# EAGLE design pcb (EAGLE 9.6.2)
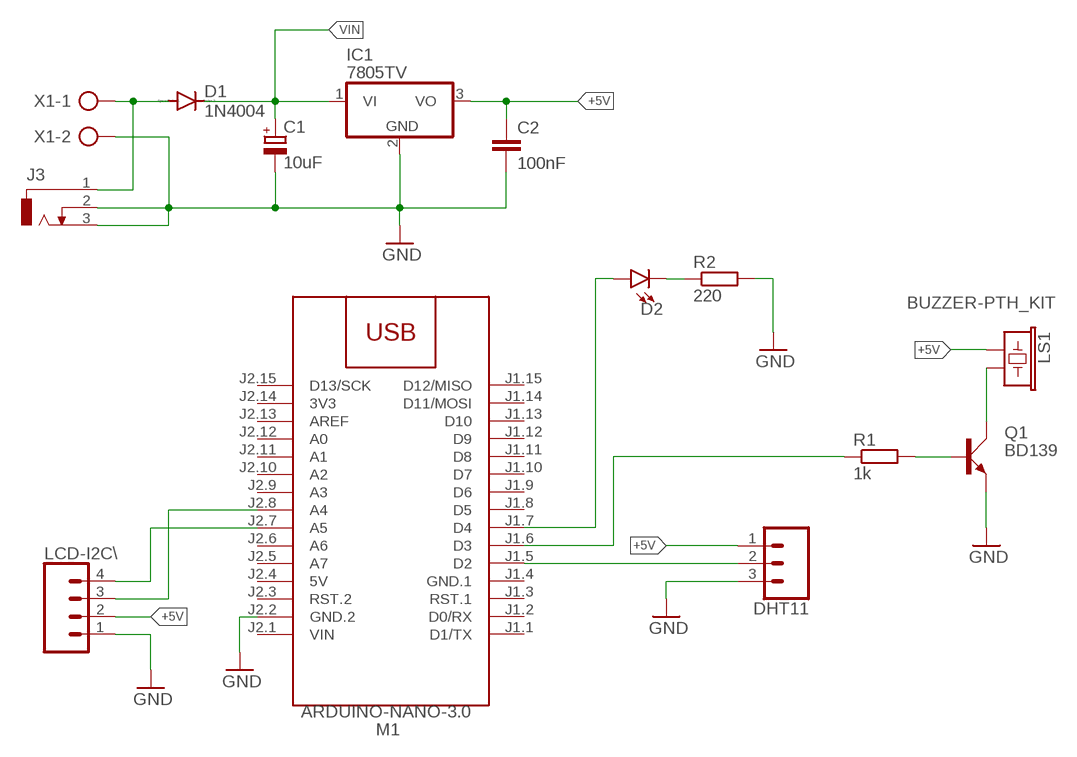
[diagram p0: schematic, sheet 1]

## Parts
C1  10uF  CPOL-EUE2.5-6  [E2,5-6]
C2  100nF  C-EU050-025X075  [C050-025X075]
D1  1N4004  [DO41-10]
D2  LED5MM  [LED_5MM]
DHT11  CONN_03LONGPADS  [1X03_LONGPADS]
IC1  7805TV  [TO220V]
J3  DCJ0303  [DCJ0303]
LCD-I2C\  CONN_04LONGPADS  [1X04_LONGPADS]
LS1  BUZZER-PTH_KIT  [BUZZER-12MM-KIT]
M1  ARDUINO-NANO-3.0  [ARDUINO-NANO-3.0]
Q1  BD139  [TO126AV]
R1  1k  R-EU_0207/10  [0207/10]
R2  220  R-EU_0207/10  [0207/10]
X1  AK300/2  [AK300/2]

## Nets
+5V: C2.1 DHT11.1 IC1.3(VO) LCD-I2C\.2 LS1.+
GND: C1.- C2.2 DHT11.3 IC1.2(GND) J3.2 J3.3 LCD-I2C\.1 M1.J2.2(GND.2) Q1.E R2.2 X1.2
N$1: M1.J1.6(D3) R1.1
N$2: DHT11.2 M1.J1.5(D2)
N$3: LCD-I2C\.4 M1.J2.7(A5)
N$4: D1.A J3.1 X1.1
N$5: LCD-I2C\.3 M1.J2.8(A4)
N$6: Q1.B R1.2
N$7: LS1.- Q1.C
N$8: D2.K(C) R2.1
N$9: D2.A M1.J1.7(D4)
VIN: C1.+ D1.C IC1.1(VI)
Unconnected: M1.J1.1(D1/TX) M1.J1.2(D0/RX) M1.J1.3(RST.1) M1.J1.8(D5) M1.J1.9(D6) M1.J1.10(D7) M1.J1.11(D8) M1.J1.12(D9) M1.J1.13(D10) M1.J1.14(D11/MOSI) M1.J1.15(D12/MISO) M1.J2.3(RST.2) M1.J2.5(A7) M1.J2.6(A6) M1.J2.9(A3) M1.J2.10(A2) M1.J2.11(A1) M1.J2.12(A0) M1.J2.13(AREF) M1.J2.15(D13/SCK)

## Power pins joined to a net without a drawn wire
3V3: M1.J2.14(3V3)
5V: M1.J2.4(5V)
GND.1: M1.J1.4(GND.1)
VIN: M1.J2.1(VIN)

## Library data of the parts
C1 = rcl:CPOL-EU: POLARIZED CAPACITOR, European symbol; SPICEPREFIX: C
C2 = rcl:C-EU: CAPACITOR, European symbol; SPICEPREFIX: C
D1 = diode:1N4004: DIODE general purpose rectifier, 1 A
D2 = SparkFun-LED:LED: LED (Generic) Standard schematic elements and footprints for 5mm, 3mm, 1206, and 0603 sized LEDs. Generic LEDs with no color specified.
DHT11 = SparkFun-Connectors:CONN_03: Multi connection point. Often used as Generic Header-pin footprint for 0.1 inch spaced/style header connections On any of the 0.1 inch spaced packages, you can populate with these: Break Away Headers - Straight <https://www.sparkfun.com/products/116> (PRT-00116) Break Away Male Headers - Right Angle <https://www.sparkfun.com/products/553> (PRT-00553) Female Headers <https://www.sparkfun.com/products/115> (PRT-00115) Break Away Headers - Machine Pin <https://www.sparkfun.com/products/117> (PRT-00117) Break Away Female Headers - Swiss Machine Pin <https://www.sparkfun.com/products/743> (PRT-00743) Stackable Header - 3 Pin (Female, 0.1") <https://www.sparkfun.com/products/13875> (PRT-13875) For SCREWTERMINALS and SPRING TERMINALS visit here: Screw Terimnals on SparkFun.com <https://www.sparkfun.com/search/results?term=Screw+Terminals> (5mm/3.5mm/2.54mm spacing) This device is also useful as a general connection point to wire up your design to another part of your project. Our various solder wires solder well into these plated through hole pads. Hook-Up Wire - Assortment (Stranded, 22 AWG) <https://www.sparkfun.com/products/11375> (PRT-11375) Hook-Up Wire - Assortment (Solid Core, 22 AWG) <https://www.sparkfun.com/products/11367> (PRT-11367) View the entire wire category on our website here <https://www.sparkfun.com/categories/141> Special notes: Molex polarized connector foot print use with SKU : PRT-08232 with associated crimp pins and housings.
IC1 = linear:78*: Positive VOLTAGE REGULATOR Source: http://cache.national.com/ds/LM/LM78L05.pdf http://www.fairchildsemi.com/ds/LM/LM7805.pdf
J3 = con-jack:DCJ0303: DC POWER JACK Source: DCJ0303.pdf; OC_FARNELL: unknown; OC_NEWARK: unknown
LCD-I2C\ = SparkFun-Connectors:CONN_04: Multi connection point. Often used as Generic Header-pin footprint for 0.1 inch spaced/style header connections On any of the 0.1 inch spaced packages, you can populate with these: Break Away Headers - Straight <https://www.sparkfun.com/products/116> (PRT-00116) Break Away Male Headers - Right Angle <https://www.sparkfun.com/products/553> (PRT-00553) Female Headers <https://www.sparkfun.com/products/115> (PRT-00115) Break Away Headers - Machine Pin <https://www.sparkfun.com/products/117> (PRT-00117) Break Away Female Headers - Swiss Machine Pin <https://www.sparkfun.com/products/743> (PRT-00743) For SCREWTERMINALS and SPRING TERMINALS visit here: Screw Terimnals on SparkFun.com <https://www.sparkfun.com/search/results?term=Screw+Terminals> (5mm/3.5mm/2.54mm spacing) This device is also useful as a general connection point to wire up your design to another part of your project. Our various solder wires solder well into these plated through hole pads. Hook-Up Wire - Assortment (Stranded, 22 AWG) <https://www.sparkfun.com/products/11375> (PRT-11375) Hook-Up Wire - Assortment (Solid Core, 22 AWG) <https://www.sparkfun.com/products/11367> (PRT-11367) View the entire wire category on our website here <https://www.sparkfun.com/categories/141> Special notes: Molex polarized connector foot print use with SKU : PRT-08231 with associated crimp pins and housings. 1MM SMD Version SKU: PRT-10208; PROD_ID: CONN-09696
LS1 = SparkFun-Electromechanical:BUZZER: Buzzer Small round buzzers that operate around the audible 2kHz range. You can use these as speakers to create simple music or user interfaces. Variant Overview: PTH - Mini Speaker - PC Mount 12mm 2.048kHz <https://www.sparkfun.com/products/7950> PTH_KIT - Mini Speaker - PC Mount 12mm 2.048kHz <https://www.sparkfun.com/products/7950> KIT simplifies soldering by adding stop mask to one side of the pads. PTH_NO_SILK - Mini Speaker - PC Mount 12mm 2.048kHz <https://www.sparkfun.com/products/7950> No silkscreen indicator of buzzer outline. PTH_KIT_NO_SILK - Mini Speaker - PC Mount 12mm 2.048kHz <https://www.sparkfun.com/products/7950> KIT package w/o silkscreen SMD - Buzzer Audio Magnetic (CCV-084B16) SMD buzzer used on, e.g. the LilyPad Buzzer <https://www.sparkfun.com/products/8463> and RFID USB Reader <https://www.sparkfun.com/products/9963>. SMD_KIT - Buzzer Audio Magnetic (CCV-084B16) SMD Buzzer with elongated pins to make soldering easier. Used on the SparkFun Simon Says - Surface Mount Soldering Kit <https://www.sparkfun.com/products/10935>.; PROD_ID: COMP-08253; SF_SKU: COM-07950
M1 = diy-modules:ARDUINO-NANO-3.0: Arduino Nano 3.0 and compatible devices More details available here: https://www.arduino.cc/en/Main/ArduinoBoardNano Click here to find device on ebay.com <http://www.ebay.com/sch/arduino+nano>
Q1 = transistor-power:BD139: NPN TRANSISTOR
R1 R2 = rcl:R-EU_: RESISTOR, European symbol; SPICEPREFIX: R
X1 = con-ptr500:AK300/2: CONNECTOR; OC_FARNELL: unknown; OC_NEWARK: unknown

## Board
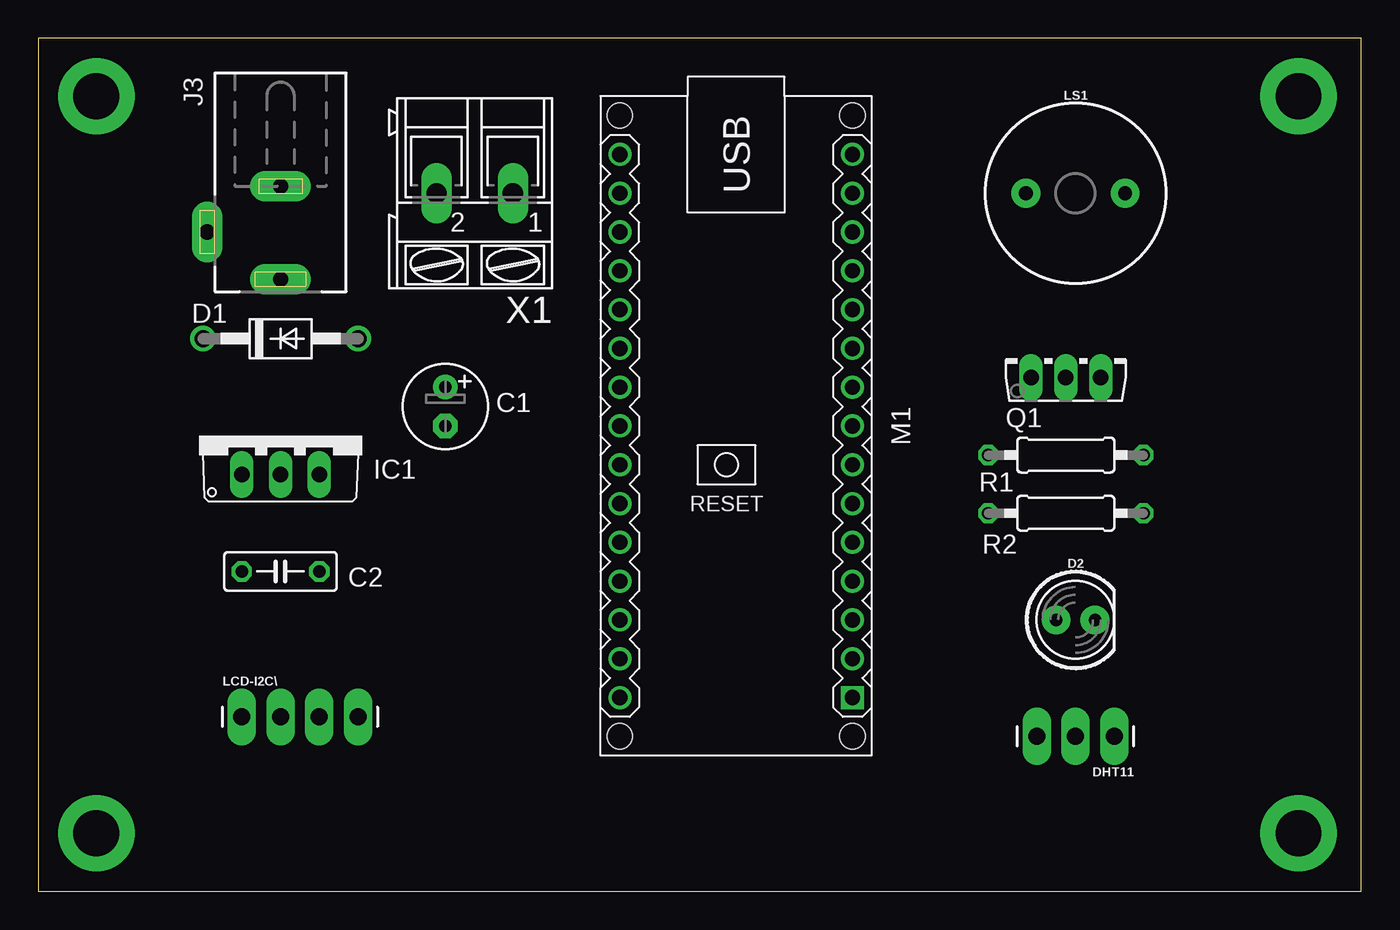
[diagram p1: board, top side]
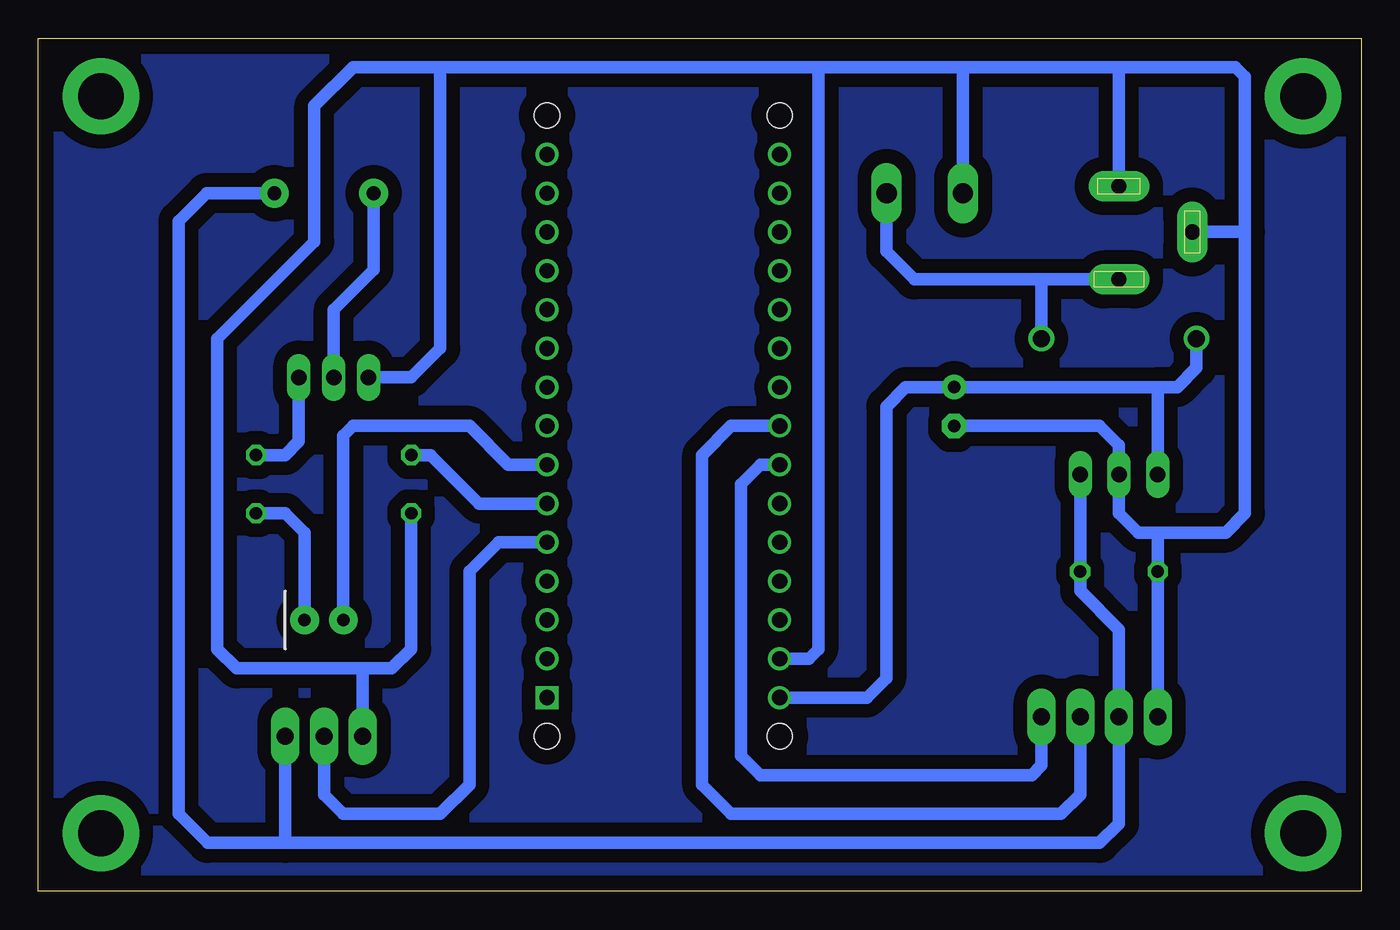
[diagram p2: board, bottom side, seen from below]

Size 86.67 x 55.87 mm. Coordinates in mm from the lower left corner, seen from the top.
Outline: 0,0 86.67,0 86.67,55.87 0,55.87 0,0
Copper layers (1*16): Top 0.035mm / dielectric 1.5mm / Bottom 0.035mm
Design rules "default": minimum track width 6mil, minimum drill 0.35mm, track to track 6mil, track to pad 6mil, pad to pad 6mil, via to via 6mil, smd to smd 6mil, copper to edge 40mil, drill to drill 6mil, minimum pad ring 10mil, minimum via ring 8mil, stop-mask expansion 4mil, vias tented up to drill 0mil, thermal gap 10mil

### Footprints (pad centres in the part's own frame; a part is rotated, then mirrored left to right if it is on the bottom)
E2,5-6 = drill 0.813 pad 1.6: + -1.27,0 | drill 0.813 pad 1.6 octagon: - 1.27,0
C050-025X075 = drill 0.813 octagon: 1 -2.54,0; 2 2.54,0
DO41-10 = drill 1.118: A 5.08,0; C -5.08,0
LED_5MM = drill 0.813 pad 1.88: A -1.27,0; K 1.27,0
1X03_LONGPADS = drill 1.118 pad 1.88 long: 1 0,0; 2 2.54,0; 3 5.08,0
TO220V = drill 1.016 long: 1 -2.54,-2.54; 2 0,-2.54; 3 2.54,-2.54
DCJ0303 = drill 1 pad 2 long: 1 0,3.1; 2 4.8,0; 3 0,-3
1X04_LONGPADS = drill 1.118 pad 1.88 long: 1 0,0; 2 2.54,0; 3 5.08,0; 4 7.62,0
BUZZER-12MM-KIT = drill 0.9 pad 1.88: + 3.25,0; - -3.25,0
ARDUINO-NANO-3.0 = drill 1 square: J1.1 17.78,7.62 | drill 1: J1.2 15.24,7.62; J1.3 12.7,7.62; J1.4 10.16,7.62; J1.5 7.62,7.62; J1.6 5.08,7.62; J1.7 2.54,7.62; J1.8 0,7.62; J1.9 -2.54,7.62; J1.10 -5.08,7.62; J1.11 -7.62,7.62; J1.12 -10.16,7.62; J1.13 -12.7,7.62; J1.14 -15.24,7.62; J1.15 -17.78,7.62; J2.1 17.78,-7.62; J2.2 15.24,-7.62; J2.3 12.7,-7.62; J2.4 10.16,-7.62; J2.5 7.62,-7.62; J2.6 5.08,-7.62; J2.7 2.54,-7.62; J2.8 0,-7.62; J2.9 -2.54,-7.62; J2.10 -5.08,-7.62; J2.11 -7.62,-7.62; J2.12 -10.16,-7.62; J2.13 -12.7,-7.62; J2.14 -15.24,-7.62; J2.15 -17.78,-7.62 | hole 1.651: -20.32,7.62; -20.32,-7.62; 20.32,-7.62; 20.32,7.62
TO126AV = drill 1.016 long: B 2.286,-1.27; C 0,-1.27; E -2.286,-1.27
0207/10 = drill 0.813 octagon: 1 -5.08,0; 2 5.08,0
AK300/2 = drill 1.321 long: 1 -2.515,0; 2 2.489,0

### Placement (x,y rotation side)
C1  26.67,31.75 270 top
C2  15.88,20.95 180 top
D1  15.88,36.2 0 top
D2  67.94,17.78 0 top
DHT11  70.48,10.16 180 top
IC1  15.88,29.84 0 top
J3  15.88,43.18 180 top
LCD-I2C\  13.34,11.43 0 top
LS1  67.94,45.72 0 top
M1  45.72,30.48 270 top
Q1  67.31,34.92 0 top
R1  67.31,28.57 0 top
R2  67.31,24.77 180 top
X1  28.57,45.72 180 top

### Tracks (layer width: path | path; a pad name or v marks a point on that pad's centre or on a via)
+5V
  Bottom 0.813: IC1.3 C2.1 18.41,19.68 15.88,17.14 LCD-I2C\.2 15.88,4.45 17.14,3.17 70.48,3.17 | LS1.+ 75.64,45.72 77.47,43.89 77.47,5.08 75.56,3.17 70.48,3.17 | DHT11.1 70.48,3.17
GND
  Bottom 0.813: 25.63,46.18 X1.2 26.09,53.92 26.04,53.98 | C1.- 17.14,30.48 15.88,29.21 IC1.2 15.88,24.77 14.61,23.5 13.34,23.5 | M1.J2.2 36.2,15.24 35.56,15.88 35.56,53.98 | LCD-I2C\.1 C2.2 13.34,23.5 | R2.2 62.23,15.88 63.5,14.61 65.41,14.61 | Q1.E 62.23,33.66 60.33,35.56 60.33,53.98 | 65.41,14.61 73.66,14.61 74.93,15.88 74.93,36.2 68.58,42.55 68.58,51.44 66.04,53.98 60.33,53.98 | 15.88,53.98 8.26,53.98 7.62,53.34 7.62,43.18 | 15.88,53.98 26.04,53.98 | 26.04,53.98 35.56,53.98 | 35.56,53.98 60.33,53.98 | DHT11.3 65.41,14.61 | J3.3 15.88,53.98 | 13.34,23.5 8.89,23.5 7.62,24.77 7.62,43.18 | J3.2 7.62,43.18
N$1
  Bottom 0.813: M1.J1.6 57.78,25.4 60.96,28.57 R1.1
N$2
  Bottom 0.813: DHT11.2 67.94,6.35 66.67,5.08 60.33,5.08 58.42,6.99 58.42,20.95 56.52,22.86 M1.J1.5
N$3
  Bottom 0.813: LCD-I2C\.4 20.95,8.26 21.59,7.62 39.37,7.62 40.64,8.89 40.64,26.67 39.37,27.94 M1.J2.7
N$4
  Bottom 0.813: J3.1 20.95,40.08 | 20.95,40.08 29.29,40.08 31.11,41.91 31.11,46.35 31.09,46.33 X1.1 | D1.A 20.95,40.08
N$5
  Bottom 0.813: LCD-I2C\.3 18.41,6.35 19.68,5.08 41.27,5.08 43.18,6.99 43.18,28.57 41.27,30.48 M1.J2.8
N$6
  Bottom 0.813: Q1.B 69.6,29.46 70.48,28.57 R1.2
N$7
  Bottom 0.813: Q1.C 67.31,38.1 64.69,40.72 LS1.-
N$8
  Bottom 0.813: D2.K 69.22,23.5 70.48,24.77 R2.1
N$9
  Bottom 0.813: M1.J1.7 55.88,27.94 58.42,30.48 66.04,30.48 66.67,29.84 D2.A
N$10  (via drill 3 pad 5)
  other vias: 3.81,52.07
N$11  (via drill 3 pad 5)
  other vias: 3.81,3.81
N$12  (via drill 3 pad 5)
  other vias: 82.55,3.81
N$13  (via drill 3 pad 5)
  other vias: 82.55,52.07
N$14
  pour Bottom (isolate 0.9): 0,55.88 86.36,55.88 86.36,0 0,0
VIN
  Bottom 0.813: D1.C 10.79,34.29 12.06,33.02 13.34,33.02 | 13.34,33.02 C1.+ 29.84,33.02 31.11,31.75 31.11,13.97 32.38,12.7 M1.J2.1 | IC1.1 13.34,33.02